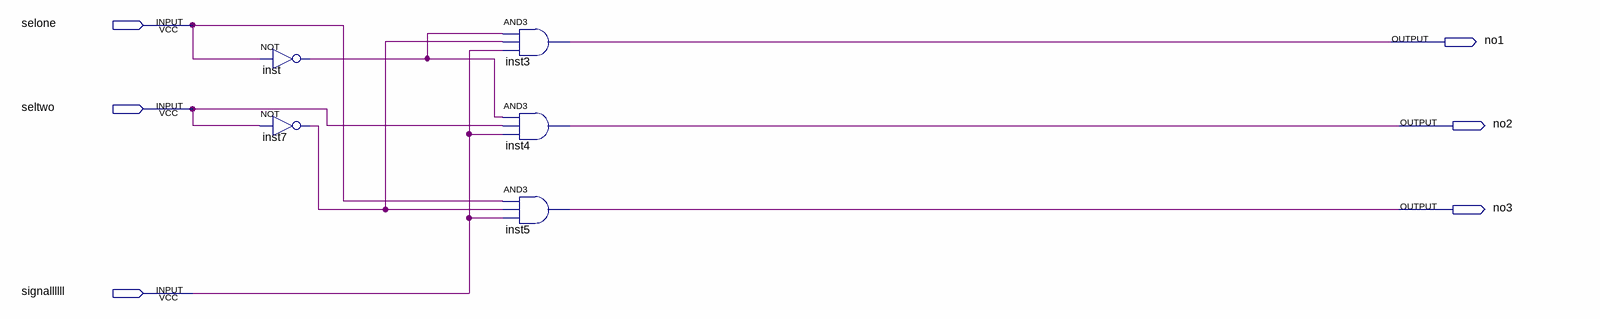
[diagram p0: schematic sheet]
// Quartus schematic dmux.bdf as structural Verilog: 5 symbols, 6 pins
module dmux (
  input  selone,
  input  seltwo,
  input  signallllll,
  output no1,
  output no2,
  output no3
);

  wire inst7_out, inst_out;

  not inst (inst_out, selone);
  not inst7 (inst7_out, seltwo);
  and inst3 (no1, inst_out, inst7_out, signallllll);
  and inst4 (no2, inst_out, seltwo, signallllll);
  and inst5 (no3, selone, inst7_out, signallllll);
endmodule
